# EAGLE design dcf77_clock (EAGLE 9.6.2)
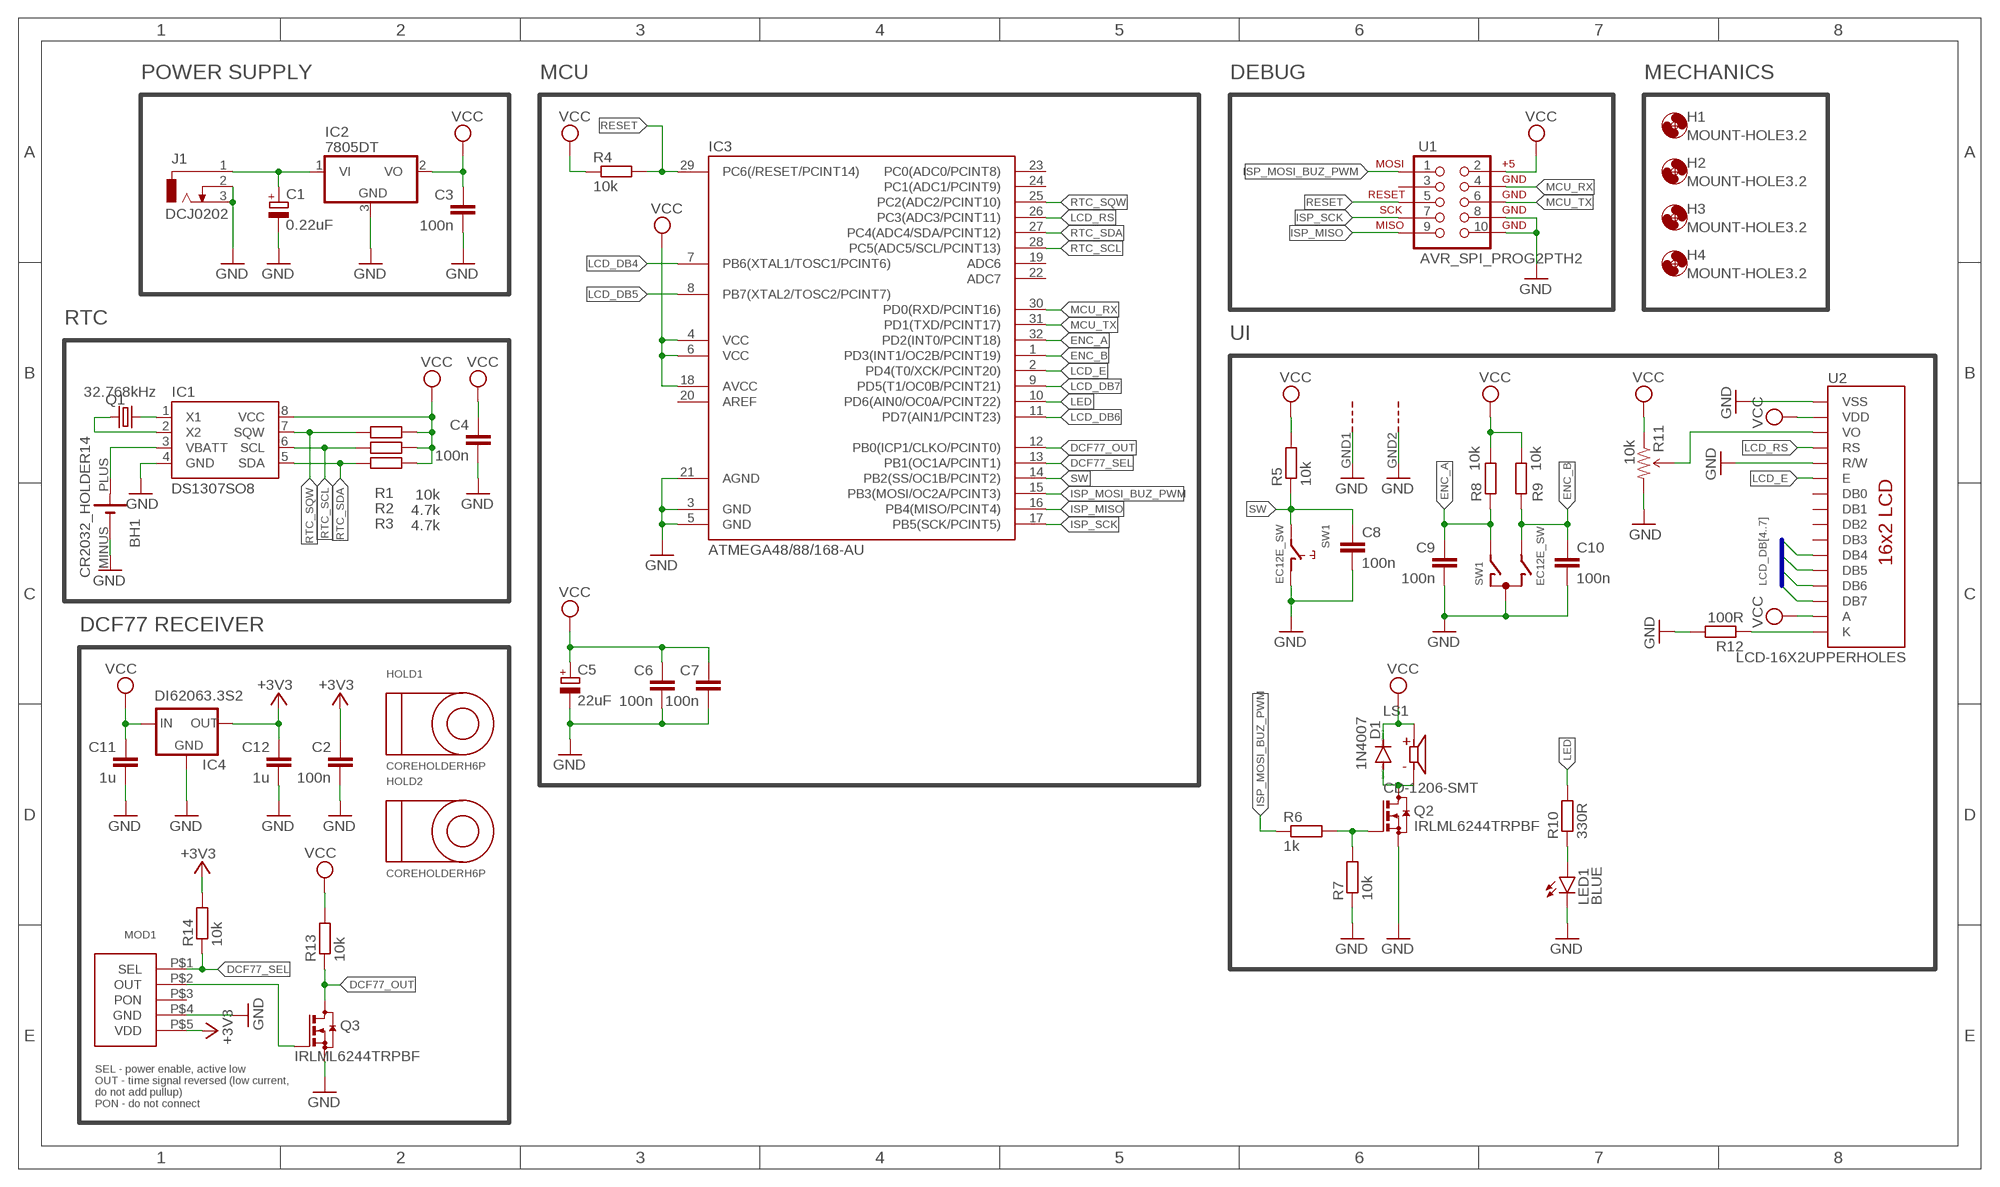
[diagram p0: schematic, sheet 1]

## Parts
BH1  CR2032_HOLDER14  [CONNFLY-DS1092-14-B6P]
C1  0.22uF  CPOL-EUSMCZ  [SMC_Z]
C2  100n  C-EUC0805K  [C0805K]
C3  100n  C-EUC0805K  [C0805K]
C4  100n  C-EUC0805K  [C0805K]
C5  22uF  CPOL-EUUD-4X5,8  [UD-4X5,8_NICHICON]
C6  100n  C-EUC0805K  [C0805K]
C7  100n  C-EUC0805K  [C0805K]
C8  100n  C-EUC0805K  [C0805K]
C9  100n  C-EUC0805K  [C0805K]
C10  100n  C-EUC0805K  [C0805K]
C11  1u  C-EUC0805K  [C0805K]
C12  1u  C-EUC0805K  [C0805K]
D1  1N4007  DIODE-SOD123  [SOD123]
H1  MOUNT-HOLE3.2  [3,2]
H2  MOUNT-HOLE3.2  [3,2]
H3  MOUNT-HOLE3.2  [3,2]
H4  MOUNT-HOLE3.2  [3,2]
HOLD1  COREHOLDERH6P  [H6P]
HOLD2  COREHOLDERH6P  [H6P]
IC1  DS1307SO8  [SO08]
IC2  7805DT  [TO252]
IC3  ATMEGA48/88/168-AU  [TQFP32-08]
IC4  DI62063.3S2  [SOT23]
J1  DCJ0202  [DCJ0202]
LED1  BLUE  LEDCHIP-LED0805  [CHIP-LED0805]
LS1  CD-1206-SMT  [CUI_CD-1206-SMT]
MOD1  DCF77MODULE  [DCF77MOD]
Q1  32.768kHz  CRYSTALMM20SS  [MM20SS]
Q2  IRLML6244TRPBF  [SOT23]
Q3  IRLML6244TRPBF  [SOT23]
R1  10k  R-EU_M0805  [M0805]
R2  4.7k  R-EU_M0805  [M0805]
R3  4.7k  R-EU_M0805  [M0805]
R4  10k  R-EU_M0805  [M0805]
R5  10k  R-EU_M0805  [M0805]
R6  1k  R-EU_M0805  [M0805]
R7  10k  R-EU_M0805  [M0805]
R8  10k  R-EU_M0805  [M0805]
R9  10k  R-EU_M0805  [M0805]
R10  330R  R-EU_M0805  [M0805]
R11  10k  TRIMPOTPTH  [TRIM_POT_PTH]
R12  100R  R-EU_M0805  [M0805]
R13  10k  R-EU_M0805  [M0805]
R14  10k  R-EU_M0805  [M0805]
SW1  EC12E_SW  [ALPS_EC12E_SW]
U1  AVR_SPI_PROG2PTH2  [2X5-SHROUDED]
U2  LCD-16X2UPPERHOLES  [LCD-16X2_UPPER_HOLES]

## Nets
+3V3: C2.1 C12.1 IC4.2(OUT) MOD1.P$5(VDD) R14.2
DCF77_OUT: IC3.12(PB0(ICP1/CLKO/PCINT0)) Q3.3(D) R13.1
DCF77_SEL: IC3.13(PB1(OC1A/PCINT1)) MOD1.P$1(SEL) R14.1
ENC_A: C9.1 IC3.32(PD2(INT0/PCINT18)) R8.1 SW1.A
ENC_B: C10.1 IC3.1(PD3(INT1/OC2B/PCINT19)) R9.1 SW1.B
GND: BH1.MINUS C1.- C2.2 C3.2 C4.2 C5.- C6.2 C7.2 C8.2 C9.2 C10.2 C11.2 C12.2 IC1.4(GND) IC2.3(GND) IC3.3(GND) IC3.5(GND) IC3.21(AGND) IC4.1(GND) J1.2 J1.3 LED1.C MOD1.P$4(GND) Q2.2(S) Q3.2(S) R7.1 R11.3(CW) R12.2 SW1.C SW1.D SW1.GND1(G) SW1.GND2(G) U1.8 U1.10 U2.1(VSS) U2.5(R/W)
ISP_MISO: IC3.16(PB4(MISO/PCINT4)) U1.9
ISP_MOSI_BUZ_PWM: IC3.15(PB3(MOSI/OC2A/PCINT3)) R6.1 U1.1
ISP_SCK: IC3.17(PB5(SCK/PCINT5)) U1.7
LCD_DB4: IC3.7(PB6(XTAL1/TOSC1/PCINT6)) U2.11(DB4)
LCD_DB5: IC3.8(PB7(XTAL2/TOSC2/PCINT7)) U2.12(DB5)
LCD_DB6: IC3.11(PD7(AIN1/PCINT23)) U2.13(DB6)
LCD_DB7: IC3.9(PD5(T1/OC0B/PCINT21)) U2.14(DB7)
LCD_E: IC3.2(PD4(T0/XCK/PCINT20)) U2.6(E)
LCD_RS: IC3.26(PC3(ADC3/PCINT11)) U2.4(RS)
LED: IC3.10(PD6(AIN0/OC0A/PCINT22)) R10.2
MCU_RX: IC3.30(PD0(RXD/PCINT16)) U1.4
MCU_TX: IC3.31(PD1(TXD/PCINT17)) U1.6
N$1: C1.+ IC2.1(VI) J1.1
N$2: D1.A LS1.M Q2.3(D)
N$3: Q2.1(G) R6.2 R7.2
N$4: LED1.A R10.1
N$6: MOD1.P$2(OUT) Q3.1(G)
N$7: R11.2(WIPER) U2.3(VO)
N$9: R12.1 U2.16(K)
N$10: IC1.1(X1) Q1.1
N$11: IC1.2(X2) Q1.4
N$12: BH1.PLUS IC1.3(VBATT)
RESET: IC3.29(PC6(/RESET/PCINT14)) R4.2 U1.5
RTC_SCL: IC1.6(SCL) IC3.28(PC5(ADC5/SCL/PCINT13)) R2.2
RTC_SDA: IC1.5(SDA) IC3.27(PC4(ADC4/SDA/PCINT12)) R3.2
RTC_SQW: IC1.7(SQW) IC3.25(PC2(ADC2/PCINT10)) R1.2
SW: C8.1 IC3.14(PB2(SS/OC1B/PCINT2)) R5.1 SW1.E
VCC: C3.1 C4.1 C5.+ C6.1 C7.1 C11.1 D1.C IC1.8(VCC) IC2.2(VO) IC3.4(VCC) IC3.6(VCC) IC3.18(AVCC) IC4.3(IN) LS1.P R1.1 R2.1 R3.1 R4.1 R5.2 R8.2 R9.2 R11.1(CCW) R13.2 U1.2 U2.2(VDD) U2.15(A)
Unconnected: IC3.19(ADC6) IC3.20(AREF) IC3.22(ADC7) IC3.23(PC0(ADC0/PCINT8)) IC3.24(PC1(ADC1/PCINT9)) MOD1.P$3(PON) U1.3 U2.7(DB0) U2.8(DB1) U2.9(DB2) U2.10(DB3)

## Buses
LCD_DB[4..7]

## Notes on the sheet
- POWER SUPPLY | MCU | DEBUG | MECHANICS
- RTC
- UI
- DCF77 RECEIVER
- SEL - power enable, active low
  OUT - time signal reversed (low current, 
  do not add pullup)
  PON - do not connect

## Library data of the parts
BH1 = dcf77:CR2032_HOLDER
C1 C5 = rcl:CPOL-EU: POLARIZED CAPACITOR, European symbol; SPICEPREFIX: C
C2-C4 C6-C12 = rcl:C-EU: CAPACITOR, European symbol; SPICEPREFIX: C
D1 = diode:DIODE-: DIODE
H1-H4 = holes:MOUNT-HOLE: MOUNTING HOLE with drill center marker
HOLD1 HOLD2 = dcf77:COREHOLDER
IC1 = SparkFun:DS1307
IC2 = linear:78*: Positive VOLTAGE REGULATOR Source: http://cache.national.com/ds/LM/LM78L05.pdf http://www.fairchildsemi.com/ds/LM/LM7805.pdf
IC3 = atmega8:ATMEGA48/88/168
IC4 = dcf77:DI62063.3S2
J1 = con-jack:DCJ0202: DC POWER JACK Source: DCJ0202.pdf; OC_FARNELL: unknown; OC_NEWARK: unknown
LED1 = led:LED: LED OSRAM: - CHIPLED LG R971, LG N971, LY N971, LG Q971, LY Q971, LO R971, LY R971 LH N974, LH R974 LS Q976, LO Q976, LY Q976 LO Q996 - Hyper CHIPLED LW Q18S LB Q993, LB Q99A, LB R99A - SideLED LS A670, LO A670, LY A670, LG A670, LP A670 LB A673, LV A673, LT A673, LW A673 LH A674 LY A675 LS A676, LA A676, LO A676, LY A676, LW A676 LS A679, LY A679, LG A679 - Hyper Micro SIDELED® LS Y876, LA Y876, LO Y876, LY Y876 LT Y87S - SmartLED LW L88C, LW L88S LB L89C, LB L89S, LG L890 LS L89K, LO L89K, LY L89K LS L896, LA L896, LO L896, LY L896 - TOPLED LS T670, LO T670, LY T670, LG T670, LP T670 LSG T670, LSP T670, LSY T670, LOP T670, LYG T670 LG T671, LOG T671, LSG T671 LB T673, LV T673, LT T673, LW T673 LH T674 LS T676, LA T676, LO T676, LY T676, LB T676, LH T676, LSB T676, LW T676 LB T67C, LV T67C, LT T67C, LS T67K, LO T67K, LY T67K, LW E67C LS E67B, LA E67B, LO E67B, LY E67B, LB E67C, LV E67C, LT E67C LW T67C LS T679, LY T679, LG T679 LS T770, LO T770, LY T770, LG T770, LP T770 LB T773, LV T773, LT T773, LW T773 LH T774 LS E675, LA E675, LY E675, LS T675 LS T776, LA T776, LO T776, LY T776, LB T776 LHGB T686 LT T68C, LB T68C - Hyper Mini TOPLED® LB M676 - Mini TOPLED Santana® LG M470 LS M47K, LO M47K, LY M47K Source: http://www.osram.convergy.de LUXEON: - LUMILED® LXK2-PW12-R00, LXK2-PW12-S00, LXK2-PW14-U00, LXK2-PW14-V00 LXK2-PM12-R00, LXK2-PM12-S00, LXK2-PM14-U00 LXK2-PE12-Q00, LXK2-PE12-R00, LXK2-PE12-S00, LXK2-PE14-T00, LXK2-PE14-U00 LXK2-PB12-K00, LXK2-PB12-L00, LXK2-PB12-M00, LXK2-PB14-N00, LXK2-PB14-P00, LXK2-PB14-Q00 LXK2-PR12-L00, LXK2-PR12-M00, LXK2-PR14-Q00, LXK2-PR14-R00 LXK2-PD12-Q00, LXK2-PD12-R00, LXK2-PD12-S00 LXK2-PH12-R00, LXK2-PH12-S00 LXK2-PL12-P00, LXK2-PL12-Q00, LXK2-PL12-R00 Source: www.luxeon.com KINGBRIGHT: KA-3528ASYC Source: www.kingbright.com
LS1 = CD-1206-SMT:CD-1206-SMT; AVAILABILITY: Unavailable; CUI_PURCHASE_URL: https://www.cui.com/product/audio/buzzers/audio-transducers/cd-1206-smt-tr?utm_source=snapeda.com&utm_medium=referral&utm_campaign=snapedaBOM; DESCRIPTION: 12 mm, 5 V, 85 dB, Surface Mount _SMT_, Sealed, Magnetic Audio Transducer Buzzer; MF: CUI Inc.; MP: CD-1206-SMT-TR; PACKAGE: 1206 CUI; PRICE: None
MOD1 = dcf77:DCF77MODULE
Q1 = crystal:CRYSTAL: CRYSTAL; OC_FARNELL: unknown; OC_NEWARK: unknown
Q2 Q3 = sosbutton:IRLML6244TRPBF: N-CHANNEL MOS FET
R1-R10 R12-R14 = rcl:R-EU_: RESISTOR, European symbol; SPICEPREFIX: R
R11 = SparkFun:TRIMPOT
SW1 = switch-alps:EC12E_SW: ALPS rotary Encoder EC12E series with switch; MPN: EC12E2424407; OC_FARNELL: 1520813; OC_NEWARK: 74M1068
U1 = SparkFun:AVR_SPI_PROG2: AVR ICSP Header This is the standard AVR In Circuit Serial Programming header. Minimal, but includes pin one indicator. Works with standard Olimex programmers. Also look for the 6-pin reduced version. Spark Fun Electronics SKU: PRT-00778
U2 = dcf77:LCD-16X2

## Board
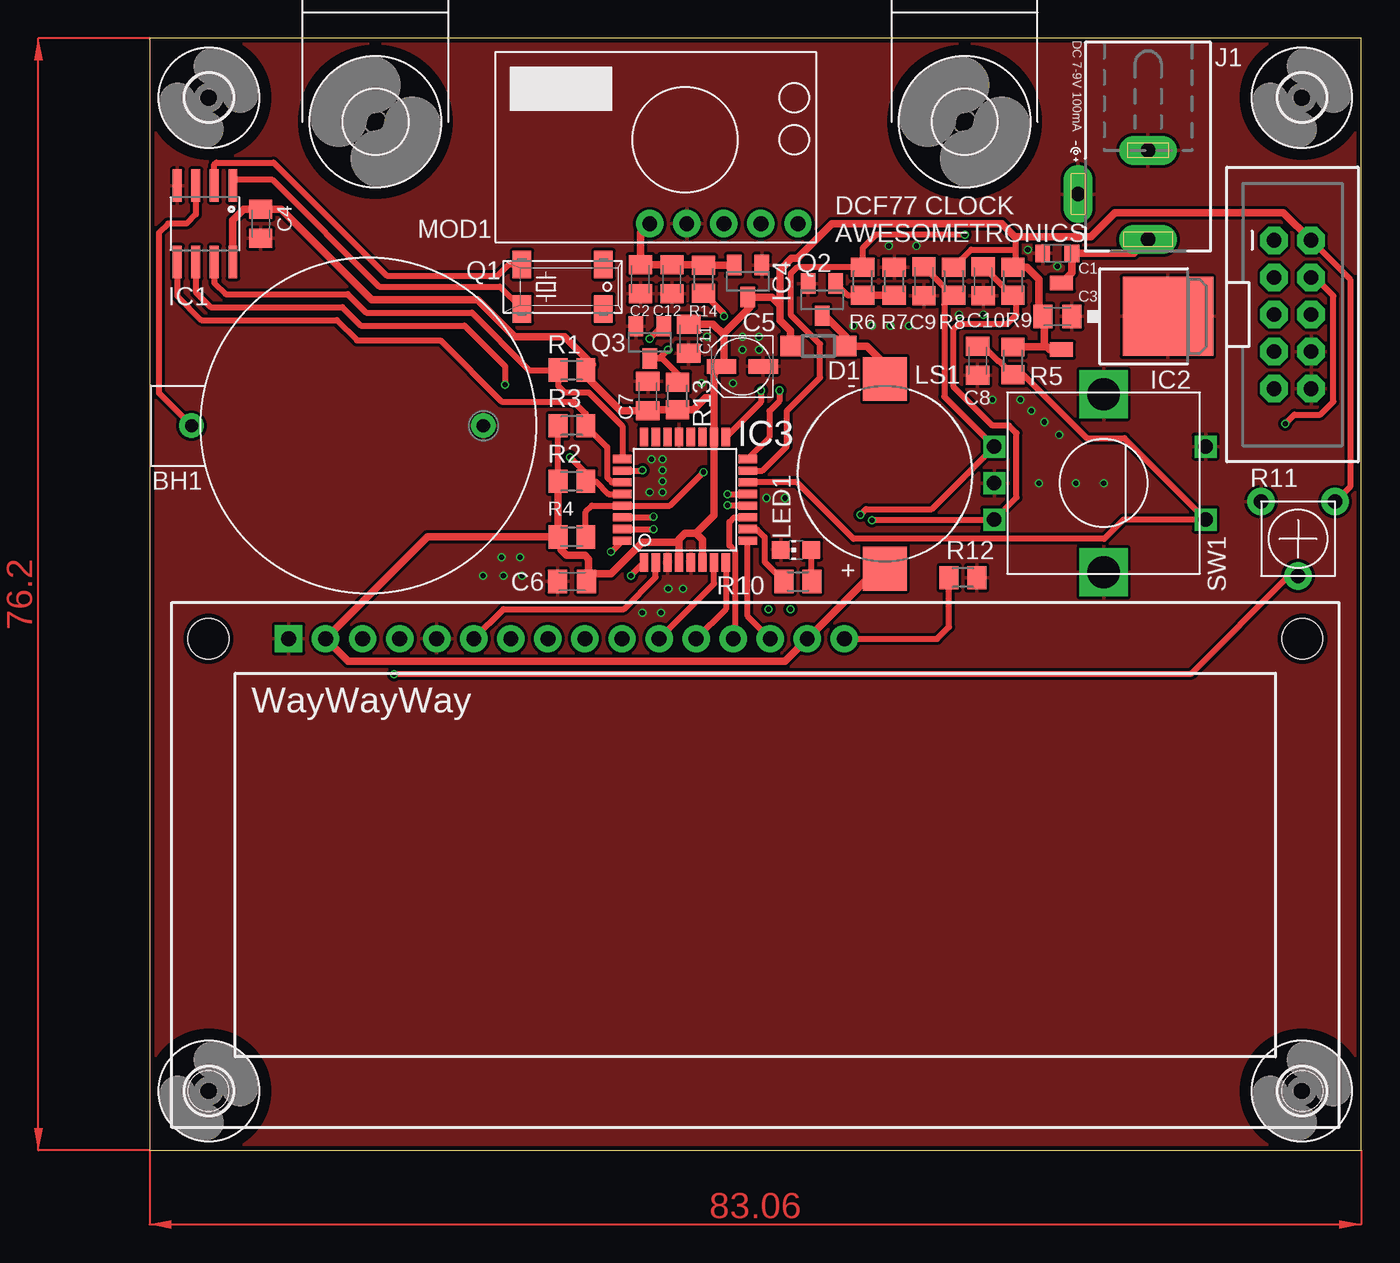
[diagram p1: board, top side]
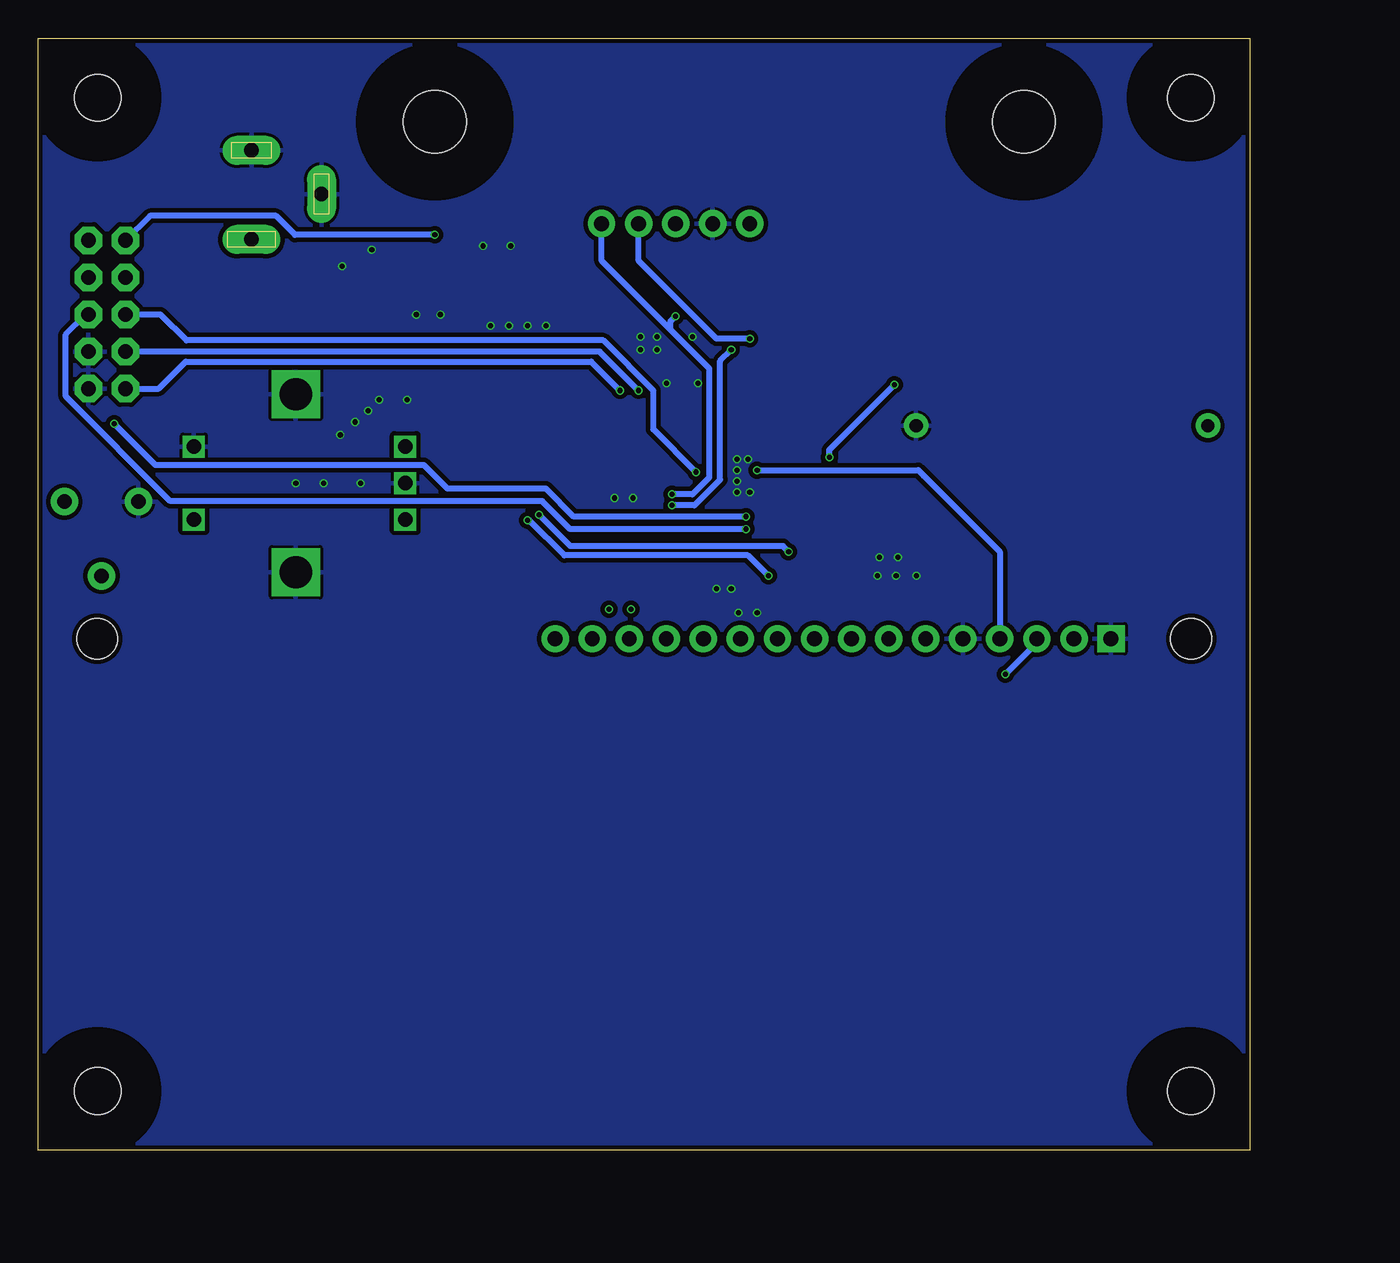
[diagram p2: board, bottom side, seen from below]

Size 83.06 x 76.2 mm. Coordinates in mm from the lower left corner, seen from the top.
Outline: 0,0 83.06,0 83.06,76.2 0,76.2 0,0
Copper layers (1*16): Top 0.035mm / dielectric 1.5mm / Bottom 0.035mm
Design rules "PCBWay_2L_152um-Track": minimum track width 6mil, minimum drill 0.3mm, track to track 6mil, track to pad 6mil, pad to pad 6mil, via to via 6mil, smd to smd 0mil, copper to edge 0.3mm, drill to drill 10mil, minimum pad ring 6mil, minimum via ring 0.1mm, stop-mask expansion 2mil, vias tented up to drill 0.45mm, thermal gap 0.2mm

### Footprints (pad centres in the part's own frame; a part is rotated, then mirrored left to right if it is on the bottom)
CONNFLY-DS1092-14-B6P = drill 0.9 pad 1.676: MINUS -7.9,0; PLUS 12.1,0
SMC_Z = smd 1 x 1.2: + -1,0; - 1,0
C0805K = smd 1.3 x 1.6: 1 -1,0; 2 1,0
UD-4X5,8_NICHICON = smd 2 x 1: + 1.425,0; - -1.425,0
SOD123 = smd 1.4 x 1.4: A 1.9,0; C -1.9,0
3,2 = hole 3.2: 0,0
H6P = hole 4.3: 0,0
SO08 = smd 0.61 x 2.21: 1 -1.905,-2.616; 2 -0.635,-2.616; 3 0.635,-2.616; 4 1.905,-2.616; 5 1.905,2.616; 6 0.635,2.616; 7 -0.635,2.616; 8 -1.905,2.616
TO252 = smd 1 x 1.6: 1 -2.28,-4.8; 2 2.28,-4.8 | smd 5.4 x 6.2: 3 0,2.5
TQFP32-08 = smd 1.27 x 0.559: 1 -4.293,2.8; 2 -4.293,2; 3 -4.293,1.2; 4 -4.293,0.4; 5 -4.293,-0.4; 6 -4.293,-1.2; 7 -4.293,-2; 8 -4.293,-2.8; 17 4.293,-2.8; 18 4.293,-2; 19 4.293,-1.2; 20 4.293,-0.4; 21 4.293,0.4; 22 4.293,1.2; 23 4.293,2; 24 4.293,2.8 | smd 0.559 x 1.27: 9 -2.8,-4.293; 10 -2,-4.293; 11 -1.2,-4.293; 12 -0.4,-4.293; 13 0.4,-4.293; 14 1.2,-4.293; 15 2,-4.293; 16 2.8,-4.293; 25 2.8,4.293; 26 2,4.293; 27 1.2,4.293; 28 0.4,4.293; 29 -0.4,4.293; 30 -1.2,4.293; 31 -2,4.293; 32 -2.8,4.293
SOT23 = smd 1 x 1.4: 1 -0.95,-1.1; 2 0.95,-1.1; 3 0,1.1
DCJ0202 = drill 1 pad 2 long: 1 0,3.1; 2 4.8,0; 3 0,-3
CHIP-LED0805 = smd 1.2 x 1.2: A 0,-1.05; C 0,1.05
CUI_CD-1206-SMT = smd 3 x 3: M 0,-6.5; P 0,6.5
DCF77MOD = drill 1.016 pad 1.88: P$1 0,0; P$2 -2.54,0; P$3 -5.08,0; P$4 -7.62,0; P$5 -10.16,0
MM20SS = smd 1.27 x 1.88: 1 -2.794,-1.524; 2 2.794,-1.524; 3 2.794,1.524; 4 -2.794,1.524
M0805 = smd 1.3 x 1.6: 1 -0.95,0; 2 0.95,0
TRIM_POT_PTH = drill 1 pad 1.88: 1 -2.54,-2.54; 2 0,2.54; 3 2.54,-2.54
ALPS_EC12E_SW = drill 1 square: A -2.5,-7.5; B 2.5,-7.5; C 0,-7.5; D -2.5,7; E 2.5,7 | drill 2.2 square: GND1 -6.1,0; GND2 6.1,0
2X5-SHROUDED = drill 1.016 pad 1.88 octagon: 1 -1.27,5.08; 2 1.27,5.08; 3 -1.27,2.54; 4 1.27,2.54; 5 -1.27,0; 6 1.27,0; 7 -1.27,-2.54; 8 1.27,-2.54; 9 -1.27,-5.08; 10 1.27,-5.08
LCD-16X2_UPPER_HOLES = drill 1.016 pad 1.88 square: 1 -32,15.5 | drill 1.016 pad 1.88: 2 -29.46,15.5; 3 -26.92,15.5; 4 -24.38,15.5; 5 -21.84,15.5; 6 -19.3,15.5; 7 -16.76,15.5; 8 -14.22,15.5; 9 -11.68,15.5; 10 -9.14,15.5; 11 -6.6,15.5; 12 -4.06,15.5; 13 -1.52,15.5; 14 1.02,15.5; 15 3.56,15.5; 16 6.1,15.5 | hole 2.8: -37.5,15.5; 37.5,15.5

### Placement (x,y rotation side)
BH1  14.99,49.66 180 top
C1  62.23,61.47 180 top
C2  33.66,59.69 270 top
C3  62.23,57.15 0 top
C4  7.62,63.5 270 top
C5  40.64,53.72 180 top
C6  28.96,38.99 180 top
C7  34.16,51.69 90 top
C8  56.77,54.1 270 top
C9  53.09,59.56 270 top
C10  57.15,59.56 270 top
C11  36.96,55.63 270 top
C12  35.81,59.69 270 top
D1  45.85,55.12 0 top
H1  4.06,72.14 0 top
H2  4.06,4.06 0 top
H3  78.99,4.06 0 top
H4  78.99,72.14 0 top
HOLD1  55.88,70.48 270 top
HOLD2  15.49,70.48 270 top
IC1  3.81,63.5 180 top
IC2  67.31,57.15 270 top
IC3  36.7,44.58 90 top
IC4  41.02,59.56 180 top
J1  68.45,65.53 180 top
LED1  44.32,41.15 90 top
LS1  50.42,46.35 180 top
MOD1  44.45,63.5 0 top
Q1  28.32,59.18 0 top
Q2  46.1,58.29 180 top
Q3  34.29,55.37 180 top
R1  28.96,53.47 180 top
R2  28.96,45.85 0 top
R3  28.96,49.66 0 top
R4  28.96,42.04 0 top
R5  59.18,54.1 90 top
R6  48.9,59.56 270 top
R7  51.05,59.56 270 top
R8  55.12,59.56 90 top
R9  59.18,59.56 90 top
R10  44.45,38.99 180 top
R11  78.74,41.91 180 top
R12  55.75,39.24 0 top
R13  36.2,51.69 270 top
R14  37.97,59.69 90 top
SW1  65.41,45.72 270 top
U1  78.36,57.28 0 top
U2  41.53,19.56 0 top

### Tracks (layer width: path | path; a pad name or v marks a point on that pad's centre or on a via)
+3V3
  Top 0.508: IC4.2 38,60.66 | 38,60.66 R14.2 | 38,60.66 37.97,60.69 C12.1 C2.1 33.66,62.87 MOD1.P$5
DCF77_OUT  (via drill 0.35)
  Top 0.406: v39.62,44.2 40.98,44.2 IC3.12 | R13.1 36.2,53.21 35.14,54.27 Q3.3 34.97,54.27 v35.56,54.86
  Bottom 0.406: v39.62,44.2 38.09,44.2 36.32,45.97 36.32,54.1 v35.56,54.86
DCF77_SEL  (via drill 0.35)
  Top 0.406: IC3.13 40.92,44.9 40.86,44.96 v39.62,44.96 | R14.1 39.37,57.34 v39.37,57.15
  Bottom 0.406: 39.75,56.26 37.08,53.59 37.08,46.1 38.23,44.96 v39.62,44.96 | 39.75,56.26 44.45,60.96 MOD1.P$1 | v39.37,57.15 39.75,56.77 39.75,56.26
ENC_A  (via drill 0.35)
  Top 0.406: C9.1 55.12,58.53 R8.1 54.48,57.98 54.48,51.64 SW1.A 53.62,43.94 49.12,43.94 v48.73,43.56 | IC3.32 31.65,41.02 v31.62,41.02
  Bottom 0.406: v31.62,41.02 32,41.4 46.58,41.4 v48.73,43.56
ENC_B  (via drill 0.35)
  Top 0.406: C10.1 59.1,58.61 R9.1 59.44,58.36 59.44,57.28 58.8,56.64 55.5,56.64 55.12,56.26 55.12,52.32 57.78,49.66 58.93,49.66 59.44,49.15 59.44,44.75 SW1.B 49.57,43.22 v49.53,43.18 | IC3.1 33.02,39.4 v33.02,39.37
  Bottom 0.406: v33.02,39.37 34.42,40.77 46.99,40.77 49.4,43.18 v49.53,43.18
GND  (via drill 0.35)
  other vias: 35.56,38.48 36.58,38.48 33.78,36.83 35.05,36.83 24.13,40.64 25.4,40.64 22.86,39.37 24.26,39.37 25.53,39.37 48.26,56.52 49.53,56.52 50.8,56.52 52.07,56.52 55.5,57.28 57.15,57.28 60.2,61.72 62.23,60.58 42.29,44.7 43.56,44.7 50.67,61.98 52.58,61.98 57.78,51.44 59.69,51.44 60.45,50.67 61.34,49.91 62.36,49.02 60.96,45.72 63.5,45.72 65.41,45.72 37.85,52.58 38.23,55.75 40.01,52.58 40.64,54.86 41.78,54.86 41.78,55.75 40.64,55.75 34.42,47.37 35.18,47.37 35.18,46.61 35.18,45.85 35.18,45.09 34.29,45.09
  pour Top (isolate 0.203): -2.54,80.01 85.09,80.01 85.09,-2.54 -2.54,-2.54
  pour Bottom (isolate 0.305): -3.81,82.55 88.9,82.55 88.9,-8.89 -12.7,-8.89 -12.7,82.55
ISP_MISO  (via drill 0.35)
  Top 0.406: v43.18,52.07 43.18,51.34 42.49,50.65 42.49,48.88 IC3.16
  Bottom 0.406: U1.9 74.8,52.2 72.95,54.05 45.16,54.05 v43.18,52.07
ISP_MOSI_BUZ_PWM  (via drill 0.35)
  Top 0.406: v55.88,62.74 55.87,62.75 49.81,62.75 48.9,61.84 R6.1 44.38,60.51 43.94,60.07 43.94,57.28 45.97,55.24 45.97,52.96 43.69,50.67 43.69,48.26 42.01,46.58 IC3.15
  Bottom 0.406: v55.88,62.74 65.46,62.74 66.76,64.04 75.4,64.04 U1.1
ISP_SCK  (via drill 0.35)
  Top 0.406: IC3.17 41.91,51.28 v41.91,52.07
  Bottom 0.406: v41.91,52.07 44.58,54.74 U1.7
LCD_DB4
  Top 0.406: U2.11 38.7,38.83 IC3.7
LCD_DB5
  Top 0.406: IC3.8 39.5,37.09 U2.12
LCD_DB6
  Top 0.406: U2.13 40.14,35.19 40.14,41.07 39.75,41.45 39.75,43.05 40.08,43.38 IC3.11
LCD_DB7
  Top 0.406: U2.14 41,36.61 IC3.9
LCD_E
  Top 0.406: U2.6 24.25,37.08 32.51,37.08 34.7,39.27 IC3.2
LCD_RS  (via drill 0.35)
  Top 0.406: IC3.26 33.75,46.58 v33.78,46.61
  Bottom 0.406: U2.4 17.15,41.02 22.35,46.23 22.54,46.42 22.73,46.61 v33.78,46.61
LED
  Top 0.406: IC3.10 41.03,42.54 41.65,42.54 42.16,42.03 42.16,40.33 R10.2
MCU_RX  (via drill 0.35)
  Top 0.406: IC3.30 34.49,43.38 v34.54,43.43 | v77.85,49.78 78.49,50.42 80.26,50.42 81.15,51.31 81.15,58.55 79.88,59.82 U1.4
  Bottom 0.406: v34.54,43.43 46.35,43.43 48.26,45.34 55.01,45.34 56.63,46.95 75.02,46.95 v77.85,49.78
MCU_TX  (via drill 0.35)
  Top 0.406: IC3.31 v34.54,42.58
  Bottom 0.406: U1.6 79.81,57.28 81.18,55.91 81.18,51.66 74,44.49 48.52,44.49 46.61,42.58 v34.54,42.58
N$1
  Top 0.508: J1.1 67.49,61.47 C1.+ 63.23,60.15 IC2.1
N$2
  Top 0.508: Q2.3 46.31,57.19 47.75,55.75 D1.A 49.17,55.12 50.42,53.87 LS1.M
N$3
  Top 0.406: Q2.1 47.83,58.61 R6.2
  Top 0.508: R7.2 R6.2
N$4
  Top 0.406: R10.1 45.37,39.02 LED1.A
N$6  (via drill 0.35)
  Top 0.406: 35.14,56.47 v34.29,55.63
  Top 0.508: Q3.1 35.14,56.47
  Bottom 0.406: v34.29,55.63 36.58,55.63 41.91,60.96 MOD1.P$2
N$7  (via drill 0.35)
  Top 0.406: R11.2 78.11,39.37 71.37,32.64 v16.76,32.64
  Bottom 0.406: v16.76,32.64 14.61,34.79 U2.3
N$9
  Top 0.406: U2.16 53.98,35.06 54.8,35.88 R12.1
N$10
  Top 0.406: IC1.1 5.71,66.5 8.43,66.5 15.75,59.18 24,59.18 Q1.1
N$11
  Top 0.406: IC1.2 4.45,67.56 4.57,67.69 8.51,67.69 16.26,59.94 23.88,59.94 24.64,60.71 Q1.4
N$12
  Top 0.406: IC1.3 3.17,64.14 2.54,63.5 1.27,63.5 0.64,62.87 0.64,51.91 BH1.PLUS
N$14  (via drill 0.35)
  other vias: 42.42,37.08
N$15  (via drill 0.35)
  other vias: 43.94,37.08
RESET  (via drill 0.35)
  Top 0.406: R4.2 29.91,43.75 30.33,44.18 IC3.29 35.67,44.18 v37.97,46.48
  Bottom 0.406: v37.97,46.48 40.89,49.4 40.89,52.07 44.32,55.5 72.9,55.5 74.68,57.28 U1.5
RTC_SCL  (via drill 0.35)
  Top 0.406: IC1.6 3.17,58.8 4.19,57.78 13.21,57.78 14.48,56.52 21.59,56.52 24.38,53.72 v24.38,52.45 | 29.97,45.85 30.61,45.85 31.48,44.98 IC3.28 | R2.2 29.97,45.85 | v28.83,47.5 29.97,46.35 29.97,45.85
  Bottom 0.406: v28.83,47.5 28.83,48.01 v24.38,52.45
RTC_SDA
  Top 0.406: IC1.5 1.91,58.55 3.56,56.9 12.83,56.9 14.22,55.5 19.94,55.5 24.13,51.31 29.08,51.31 29.91,50.48 R3.2 31.37,48.19 31.37,46.1 31.69,45.78 IC3.27
RTC_SQW
  Top 0.406: IC1.7 4.45,59.44 5.21,58.67 13.59,58.67 14.86,57.4 22.1,57.4 26.04,53.47 R1.2 28.01,52.38 28.45,51.94 30.1,51.94 32.41,49.63 IC3.25
SW
  Top 0.406: C8.1 57.18,55.1 58.23,54.05 58.29,54.05 R5.1 59.89,53.15 64.24,48.8 66.83,48.8 SW1.E 66.76,43.22 65.45,41.91 48.26,41.91 44.39,45.78 IC3.14
VCC
  Top 0.406: C6.1 30.1,38.99 30.1,39.5 | R4.1 28.19,41.85 28.19,41.15 | R2.1 R3.1 | 61.34,57.04 C3.1 60.96,57.42 | 61.34,55.24 61.47,55.12 61.4,55.05 | 49.89,39.85 LS1.P | 59.31,62.61 59.37,62.55 59.37,61.72 | 60.14,60.51 59.31,60.51 | 59.31,60.51 R9.2 | 59.37,61.72 59.37,60.57 59.31,60.51 | 30.35,53.85 29.97,53.47 R1.1 | U1.2 82.3,59.69 82.3,45.47 R11.1 | R8.2 56.33,61.72 59.37,61.72
  Top 0.508: IC1.8 5.71,63.75 6.46,64.5 C4.1 9.03,64.5 15.24,58.29 22.48,58.29 25.02,55.75 28.45,55.75 30.35,53.85 | IC3.6 37.9,41.85 37.47,42.29 | 37.47,42.29 36.7,42.29 36.3,41.89 36.3,41.66 | 36.3,41.66 IC3.4 | 37.47,42.29 38.7,43.53 IC3.18 38.7,51.56 | R1.1 29.91,53.09 32.3,50.69 C7.1 34.21,50.74 R13.2 37.28,50.74 38.1,51.56 38.7,51.56 | R2.1 R4.1 19.05,42.04 U2.2 13.6,33.53 43.56,33.53 U2.15 49.89,39.85 | 36.3,41.66 33.78,41.66 31.62,39.5 30.1,39.5 30.1,40.51 29.84,40.77 28.57,40.77 28.19,41.15 | 61.34,57.04 61.34,55.24 | 61.47,55.12 61.72,54.87 IC2.2 | 38.7,51.56 38.7,53.21 C5.+ 39.37,53.88 39.37,55.88 | 60.96,57.42 60.96,59.69 60.14,60.51 R9.2 | R5.2 61.4,55.05 | U1.2 77.72,64.26 66.17,64.26 64.52,62.61 59.31,62.61 58.42,63.5 46.79,63.5 44.45,61.16 44.45,61.12 44,61.12 43.2,60.32 43.2,57.91 | D1.C 43.95,56.16 43.2,56.9 43.2,57.91 | C11.1 38.62,56.63 39.37,55.88 | 39.37,55.88 39.37,56.01 41.15,57.78 41.15,58.34 IC4.3 42.65,58.46 43.2,57.91
(copper drawn outside any net)
  shapes: Top area x4

### Text on the board
tPlace: DCF77 CLOCK / AWESOMETRONICS
tNames: DC 7-9V 100mA | WayWayWay